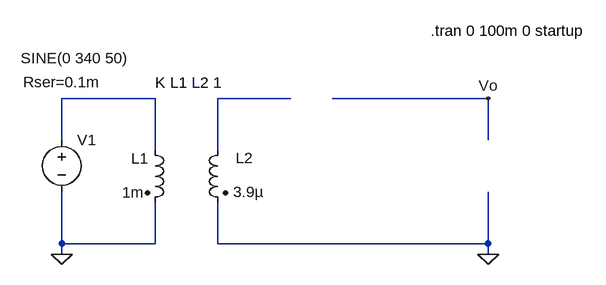
[diagram p0: schematic rectifier_half_wave240.asc]
rectifier_half_wave240.asc, the LTspice schematic file:
Version 4
SHEET 1 880 680
WIRE -352 -48 -496 -48
WIRE -144 -48 -256 -48
WIRE 160 -48 -80 -48
WIRE -496 16 -496 -48
WIRE 160 16 160 -48
WIRE -352 32 -352 -48
WIRE -256 32 -256 -48
WIRE -496 176 -496 96
WIRE -352 176 -352 112
WIRE -352 176 -496 176
WIRE -256 176 -256 112
WIRE 160 176 160 96
WIRE 160 176 -256 176
WIRE -496 192 -496 176
WIRE 160 192 160 176
FLAG 160 -48 Vo
FLAG 160 192 0
FLAG -496 192 0
SYMBOL ind2 -368 16 R0
WINDOW 0 -21 29 Left 2
WINDOW 3 -35 81 Left 2
SYMATTR InstName L1
SYMATTR Value 1m
SYMATTR Type ind
SYMBOL ind2 -240 16 M0
WINDOW 0 -39 28 Left 2
WINDOW 3 -55 80 Left 2
SYMATTR InstName L2
SYMATTR Value 3.9µ
SYMATTR Type ind
SYMBOL voltage -496 0 R0
WINDOW 3 -63 -110 Left 2
WINDOW 123 0 0 Left 2
WINDOW 39 -59 -73 Left 2
SYMATTR Value SINE(0 340 50)
SYMATTR SpiceLine Rser=0.1m
SYMATTR InstName V1
TEXT 72 -152 Left 2 !.tran 0 100m 0 startup
TEXT -352 -72 Left 2 !K L1 L2 1

The netlist it stands for:
* rectifier_half_wave240.asc
L1 N001 0 1m
L2 N002 0 3.9µ
V1 N001 0 SINE(0 340 50) Rser=0.1m
.tran 0 100m 0 startup
K L1 L2 1
.backanno
.end